# EAGLE design basestation_lorawan (EAGLE 9.6.2)
COMPONENTS: LoRaWAN; DESCRIPTION: Basismodul; DRAWING_VERSION: 1.0; DRAWN: Tobias Poppe; FIRMA: Tobias Poppe; PRINTDATE: 30.01.2023; PROJECT: Open-WaLeS; STATUS: Prod.

## Sheet 1 of 2
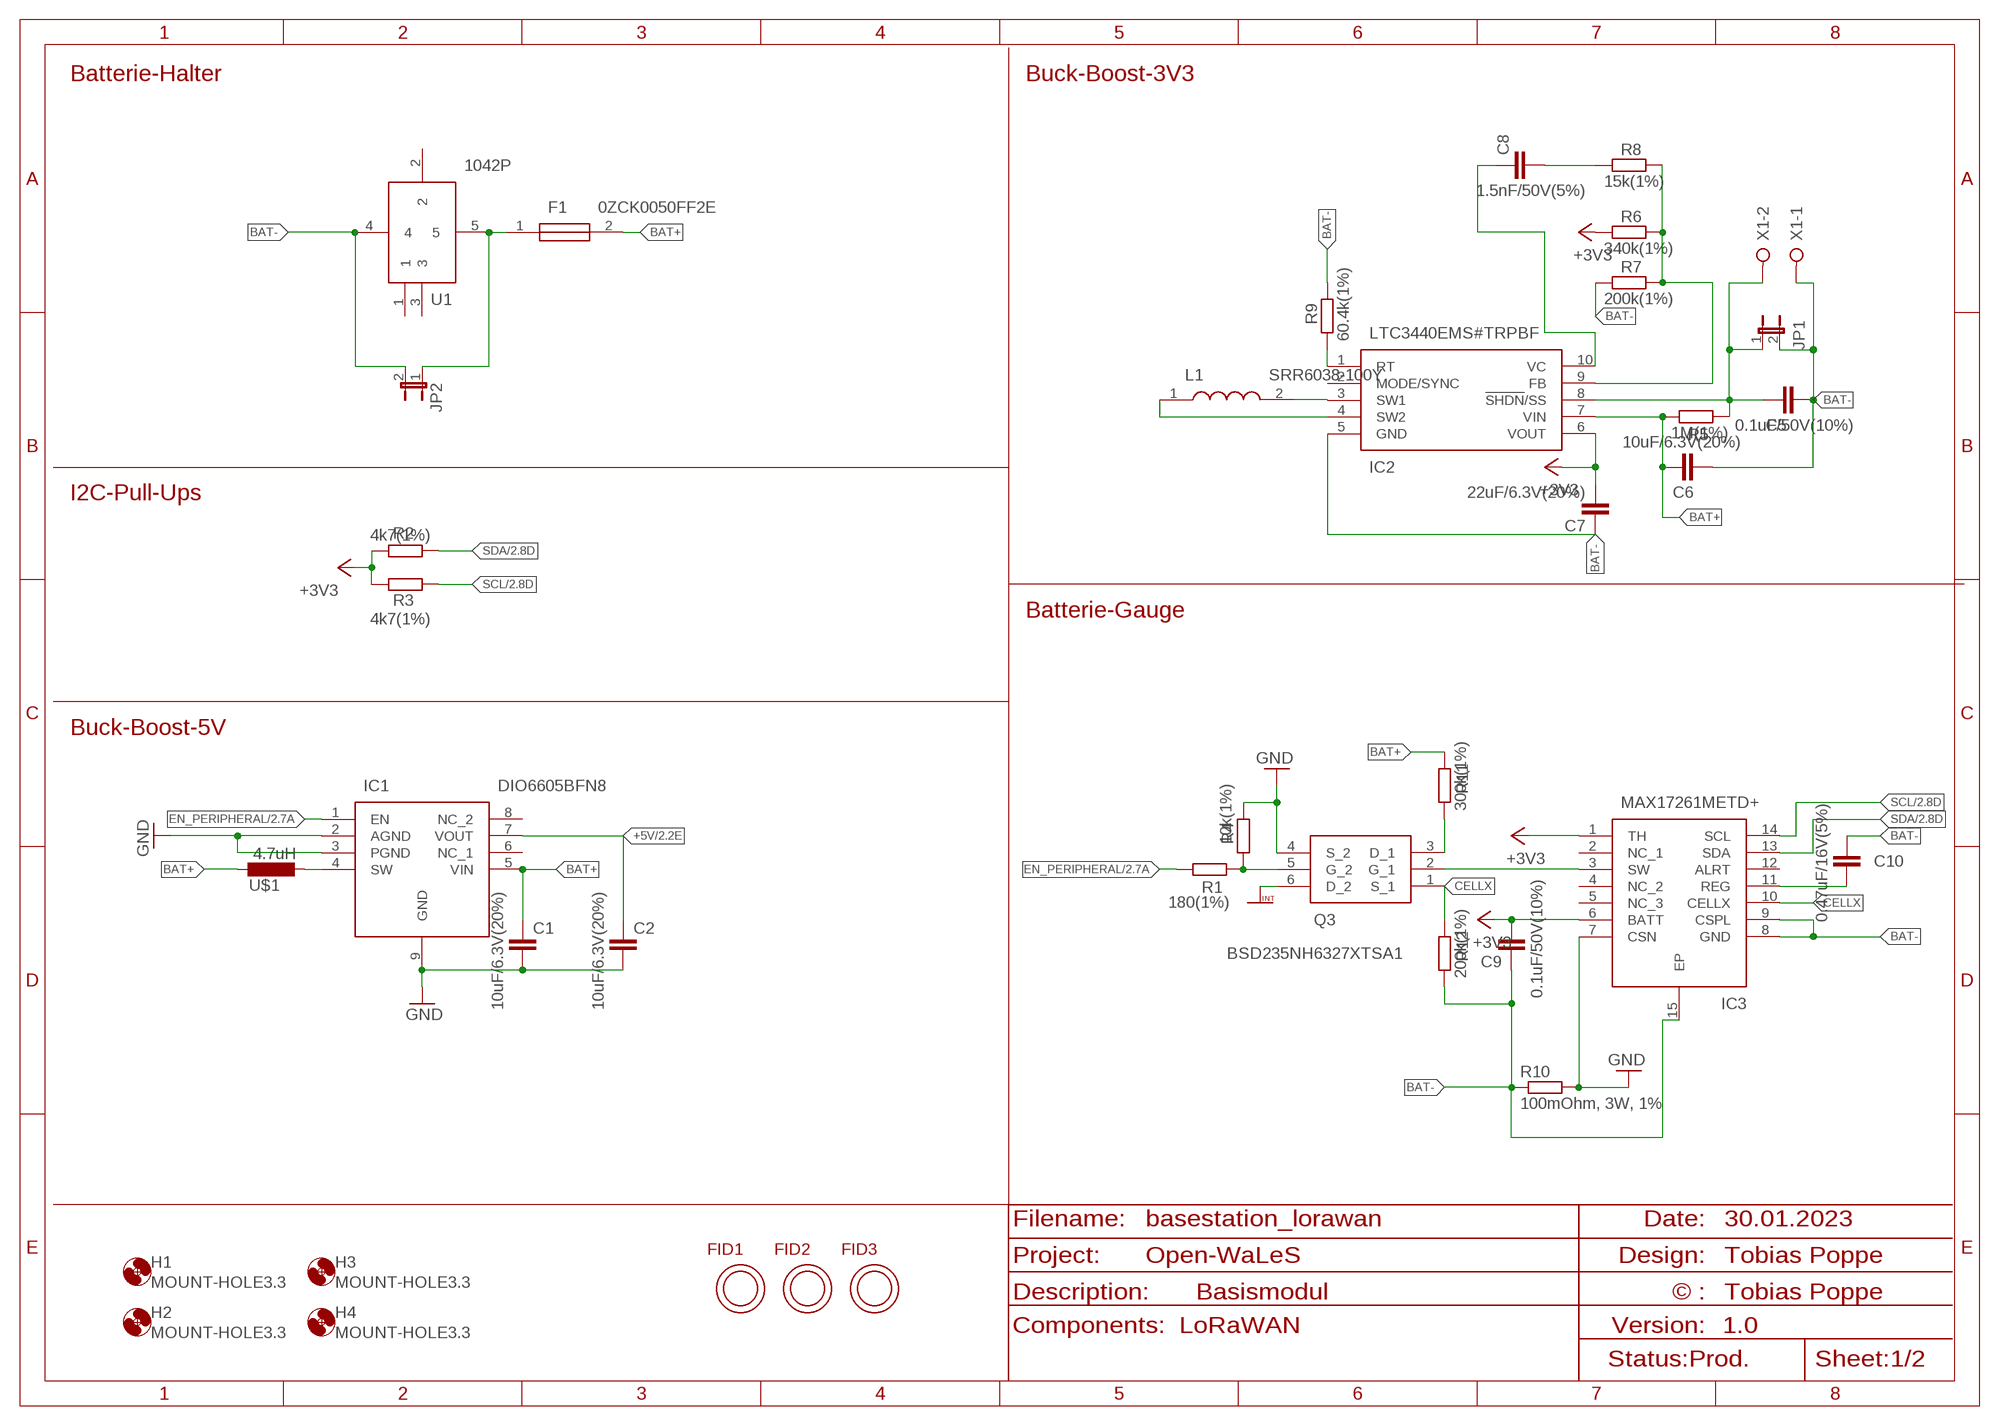
[diagram p0: schematic, sheet 1]

### Parts
C1  10uF/6.3V(20%)  C-EUC0805  [C0805]
C2  10uF/6.3V(20%)  C-EUC0805  [C0805]
C5  0.1uF/50V(10%)  C-EUC0805  [C0805]
C6  10uF/6.3V(20%)  C-EUC0805  [C0805]
C7  22uF/6.3V(20%)  C-EUC0805K  [C0805K]
C8  1.5nF/50V(5%)  C-EUC0805  [C0805]
C9  0.1uF/50V(10%)  C-EUC0805  [C0805]
C10  0.47uF/16V(5%)  C-EUC0805  [C0805]
F1  0ZCK0050FF2E  [FUSC2214X125N]
FID1  OPEN-PNP-FIDUCIAL  [OPEN-PNP-FIDUCIAL]
FID2  OPEN-PNP-FIDUCIAL  [OPEN-PNP-FIDUCIAL]
FID3  OPEN-PNP-FIDUCIAL  [OPEN-PNP-FIDUCIAL]
H1  MOUNT-HOLE3.3  [3,3]
H2  MOUNT-HOLE3.3  [3,3]
H3  MOUNT-HOLE3.3  [3,3]
H4  MOUNT-HOLE3.3  [3,3]
IC1  DIO6605BFN8  [SON50P300X200X80-9N]
IC2  LTC3440EMS#TRPBF  [SOP50P490X110-10N]
IC3  MAX17261METD+  [SON40P300X300X80-15N]
JP1  JP1E  [JP1]
JP2  JP1E  [JP1]
L1  SRR6038-100Y  SRR6038-330Y  [SRR6038330Y]
Q3  BSD235NH6327XTSA1  [SOT65P210X100-6N]
R1  180(1%)  R-EU_M0805  [M0805]
R2  4k7(1%)  R-EU_M0805  [M0805]
R3  4k7(1%)  R-EU_M0805  [M0805]
R4  10k(1%)  R-EU_M0805  [M0805]
R5  1M(1%)  R-EU_M0805  [M0805]
R6  340k(1%)  R-EU_M0805  [M0805]
R7  200k(1%)  R-EU_M0805  [M0805]
R8  15k(1%)  R-EU_M0805  [M0805]
R9  60.4k(1%)  R-EU_M0805  [M0805]
R10  100mOhm, 3W, 1%  R-EU_R2512  [R2512]
R11  300k(1%)  R-EU_M0805  [M0805]
R12  200k(1%)  R-EU_M0805  [M0805]
U1  1042P  [1042P]
U$1  4.7uH  L-0805  [R0805]
X1  W237-02P  [W237-132]

### Nets
+3V3: C7.2 C9.2 IC2.6(VOUT) IC3.1(TH) IC3.6(BATT) R2.2 R3.2 R6.1 ; also sheet 2
+5V: C2.1 IC1.7(VOUT) ; also sheet 2
BAT+: C1.1 C6.2 F1.2 IC1.5(VIN) IC2.7(VIN) R5.1 R11.2 U$1.1
BAT+_UNFUSED: F1.1 JP2.1 U1.5
BAT-: C5.2 C6.1 C7.1 C9.1 C10.1 IC2.5(GND) IC3.8(GND) IC3.9(CSPL) IC3.15(EP) JP1.2 JP2.2 R7.1 R9.2 R10.1 R12.1 U1.4 X1.1
CELLX: IC3.10(CELLX) Q3.1(S_1) R12.2
EN_PERIPHERAL: IC1.1(EN) R1.2 ; also sheet 2
GND: C1.2 C2.2 IC1.2(AGND) IC1.3(PGND) IC1.9(GND) IC3.7(CSN) Q3.4(S_2) R4.2 R10.2 ; also sheet 2
GNDINT: Q3.6(D_2) ; also sheet 2
N$1: IC1.4(SW) U$1.2
N$2: Q3.5(G_2) R1.1 R4.1
N$7: IC2.3(SW1) L1.2
N$8: IC2.4(SW2) L1.1
N$9: IC2.9(FB) R6.2 R7.2 R8.2
N$10: C5.1 IC2.8(!SHDN!/SS) JP1.1 R5.2 X1.2
N$11: C8.2 R8.1
N$12: C8.1 IC2.10(VC)
N$14: Q3.3(D_1) R11.1
REG: C10.2 IC3.11(REG)
RT: IC2.1(RT) R9.1
SCL: IC3.14(SCL) R3.1 ; also sheet 2
SDA: IC3.13(SDA) R2.1 ; also sheet 2
SW: IC3.3(SW) Q3.2(G_1)
Unconnected: IC1.6(NC_1) IC1.8(NC_2) IC2.2(MODE/SYNC) IC3.2(NC_1) IC3.4(NC_2) IC3.5(NC_3) IC3.12(ALRT) U1.1 U1.2 U1.3

### Notes on the sheet
- Batterie-Halter | Buck-Boost-3V3
- I2C-Pull-Ups
- Batterie-Gauge
- Buck-Boost-5V

## Sheet 2 of 2
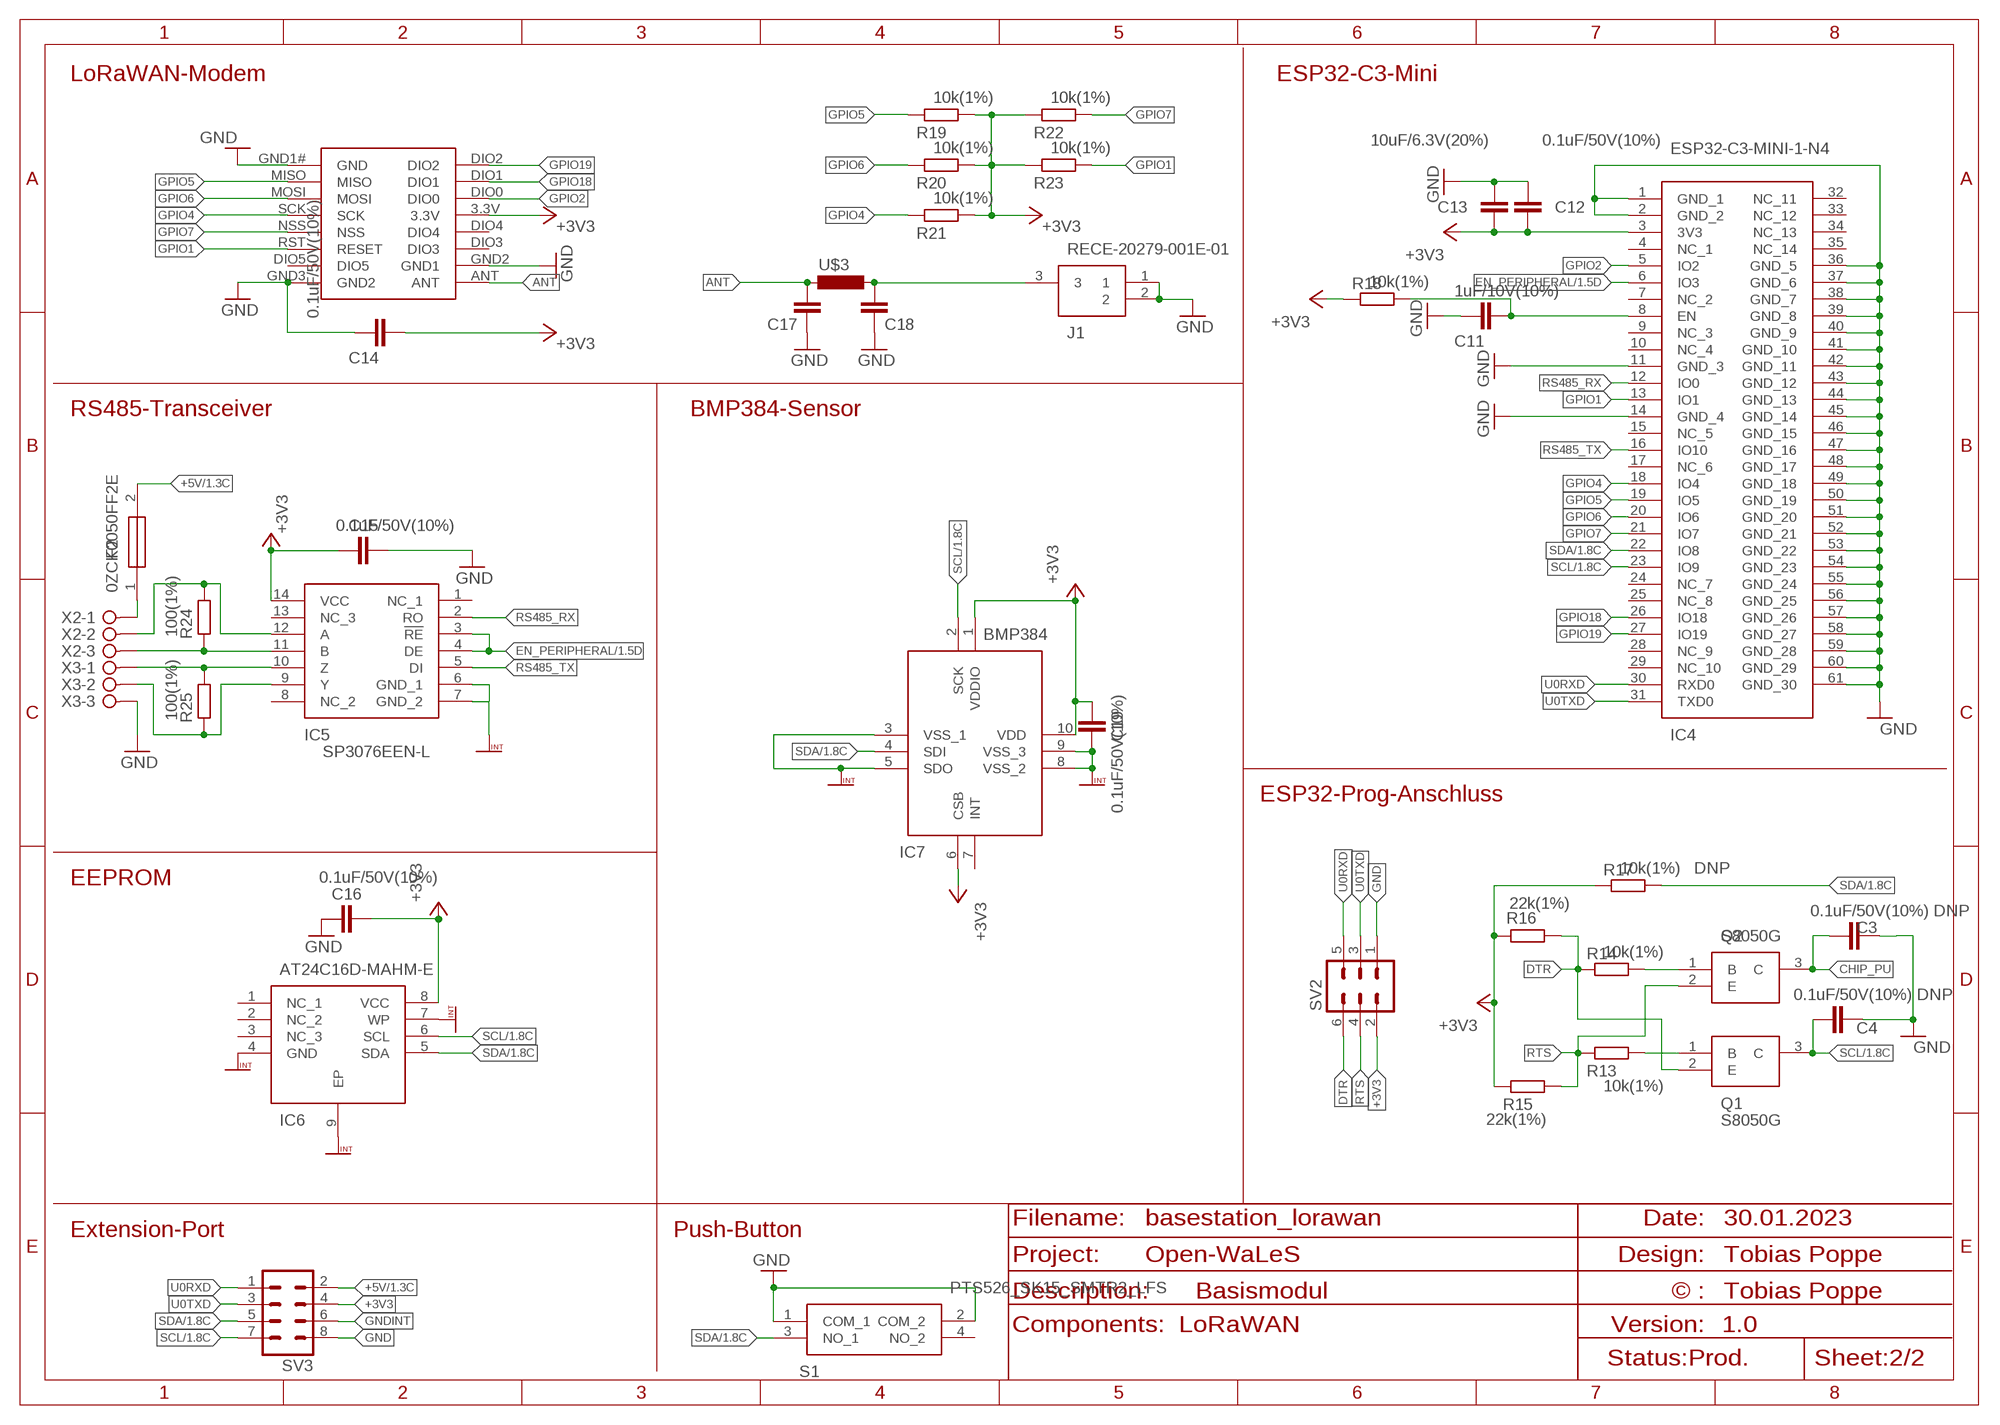
[diagram p1: schematic, sheet 2]

### Parts
C3  0.1uF/50V(10%) DNP  C-EUC0805  [C0805]
C4  0.1uF/50V(10%) DNP  C-EUC0805  [C0805]
C11  1uF/10V(10%)  C-EUC0805  [C0805]
C12  0.1uF/50V(10%)  C-EUC0805  [C0805]
C13  10uF/6.3V(20%)  C-EUC0805  [C0805]
C14  0.1uF/50V(10%)  C-EUC0805  [C0805]
C15  0.1uF/50V(10%)  C-EUC0805  [C0805]
C16  0.1uF/50V(10%)  C-EUC0805  [C0805]
C17  C-EUC0805K  [C0805K]
C18  C-EUC0805K  [C0805K]
C19  0.1uF/50V(10%)  C-EUC0805  [C0805]
F2  0ZCK0050FF2E  [FUSC2214X125N]
IC4  ESP32-C3-MINI-1-N4  [ESP32C3MINI1N4]
IC5  SP3076EEN-L  [SOIC127P600X175-14N]
IC6  AT24C16D-MAHM-E  [SON50P300X200X60-9N]
IC7  BMP384  [BMP384]
J1  RECE-20279-001E-01  [RECE.20279.001E.01]
Q1  S8050G  [SOT95P240X110-3N]
Q2  S8050G  [SOT95P240X110-3N]
R13  10k(1%)  R-EU_M0805  [M0805]
R14  10k(1%)  R-EU_M0805  [M0805]
R15  22k(1%)  R-EU_M0805  [M0805]
R16  22k(1%)  R-EU_M0805  [M0805]
R17  10k(1%) DNP  R-EU_M0805  [M0805]
R18  10k(1%)  R-EU_M0805  [M0805]
R19  10k(1%)  R-EU_M0805  [M0805]
R20  10k(1%)  R-EU_M0805  [M0805]
R21  10k(1%)  R-EU_M0805  [M0805]
R22  10k(1%)  R-EU_M0805  [M0805]
R23  10k(1%)  R-EU_M0805  [M0805]
R24  100(1%)  R-EU_M0805  [M0805]
R25  100(1%)  R-EU_M0805  [M0805]
S1  PTS526_SK15_SMTR2_LFS  [PTS526SK15SMTR2LFS]
SV2  MA03-2  [MA03-2]
SV3  MA04-2  [MA04-2]
U$2  RFM95W  [RFM95W]
U$3  L-0805  [R0805]
X2  W237-3E  [W237-3E]
X3  W237-3E  [W237-3E]

### Nets
+3V3: C12.1 C13.2 C14.1 C15.1 C16.2 C19.1 IC4.3(3V3) IC5.14(VCC) IC6.8(VCC) IC7.1(VDDIO) IC7.6(CSB) IC7.10(VDD) R15.2 R16.1 R17.2 R18.2 R19.1 R20.1 R21.1 R22.2 R23.2 SV2.2 SV3.4 U$2.3.3V ; also sheet 1
+5V: F2.2 SV3.2 ; also sheet 1
A: IC5.12(A) R24.2 X2.2
ANT: C17.1 U$2.ANT U$3.1
B: IC5.11(B) R24.1 X2.3
CHIP_PU: C3.2 C11.1 IC4.8(EN) Q2.3(C) R18.1
DTR: Q1.2(E) R14.2 R16.2 SV2.6
EN_PERIPHERAL: IC4.6(IO3) IC5.3(!RE) IC5.4(DE) ; also sheet 1
GND: C3.1 C4.1 C11.2 C12.2 C13.1 C14.2 C15.2 C16.1 C17.2 C18.2 IC4.1(GND_1) IC4.2(GND_2) IC4.11(GND_3) IC4.14(GND_4) IC4.36(GND_5) IC4.37(GND_6) IC4.38(GND_7) IC4.39(GND_8) IC4.40(GND_9) IC4.41(GND_10) IC4.42(GND_11) IC4.43(GND_12) IC4.44(GND_13) IC4.45(GND_14) IC4.46(GND_15) IC4.47(GND_16) IC4.48(GND_17) IC4.49(GND_18) IC4.50(GND_19) IC4.51(GND_20) IC4.52(GND_21) IC4.53(GND_22) IC4.54(GND_23) IC4.55(GND_24) IC4.56(GND_25) IC4.57(GND_26) IC4.58(GND_27) IC4.59(GND_28) IC4.60(GND_29) IC4.61(GND_30) J1.1 J1.2 S1.1(COM_1) S1.2(COM_2) SV2.1 SV3.8 U$2.GND1#(GND) U$2.GND2(GND1) U$2.GND3(GND2) X3.3 ; also sheet 1
GNDINT: C19.2 IC5.6(GND_1) IC5.7(GND_2) IC6.4(GND) IC6.7(WP) IC6.9(EP) IC7.3(VSS_1) IC7.5(SDO) IC7.8(VSS_2) IC7.9(VSS_3) SV3.6 ; also sheet 1
GPIO1: IC4.13(IO1) R23.1 U$2.RST(RESET)
GPIO2: IC4.5(IO2) U$2.DIO0
GPIO4: IC4.18(IO4) R21.2 U$2.SCK
GPIO5: IC4.19(IO5) R19.2 U$2.MISO
GPIO6: IC4.20(IO6) R20.2 U$2.MOSI
GPIO7: IC4.21(IO7) R22.1 U$2.NSS
GPIO18: IC4.26(IO18) U$2.DIO1
GPIO19: IC4.27(IO19) U$2.DIO2
N$3: Q2.1(B) R14.1
N$4: Q1.1(B) R13.1
N$16: F2.1 X2.1
N$19: C18.1 J1.3 U$3.2
RS485_RX: IC4.12(IO0) IC5.2(RO)
RS485_TX: IC4.16(IO10) IC5.5(DI)
RTS: Q2.2(E) R13.2 R15.1 SV2.4
SCL: C4.2 IC4.23(IO9) IC6.6(SCL) IC7.2(SCK) Q1.3(C) SV3.7 ; also sheet 1
SDA: IC4.22(IO8) IC6.5(SDA) IC7.4(SDI) R17.1 S1.3(NO_1) SV3.5 ; also sheet 1
U0RXD: IC4.30(RXD0) SV2.5 SV3.1
U0TXD: IC4.31(TXD0) SV2.3 SV3.3
Y: IC5.9(Y) R25.1 X3.2
Z: IC5.10(Z) R25.2 X3.1
Unconnected: IC4.4(NC_1) IC4.7(NC_2) IC4.9(NC_3) IC4.10(NC_4) IC4.15(NC_5) IC4.17(NC_6) IC4.24(NC_7) IC4.25(NC_8) IC4.28(NC_9) IC4.29(NC_10) IC4.32(NC_11) IC4.33(NC_12) IC4.34(NC_13) IC4.35(NC_14) IC5.1(NC_1) IC5.8(NC_2) IC5.13(NC_3) IC6.1(NC_1) IC6.2(NC_2) IC6.3(NC_3) IC7.7(INT) S1.4(NO_2) U$2.DIO3 U$2.DIO4 U$2.DIO5

### Notes on the sheet
- LoRaWAN-Modem | ESP32-C3-Mini
- RS485-Transceiver | BMP384-Sensor
- ESP32-Prog-Anschluss
- EEPROM
- Extension-Port | Push-Button

## Library data of the parts
C1 C2 C6 C13 = rcl:C-EU: CAPACITOR, European symbol; MOUSER: 963-JMK212BJ106MG-T; SPICEPREFIX: C
C3-C5 C9 C12 C14-C16 C19 = rcl:C-EU: CAPACITOR, European symbol; MOUSER: 80-C0805C104K5RACLR; SPICEPREFIX: C
C7 = rcl:C-EU: CAPACITOR, European symbol; MOUSER: 710-885012107005; SPICEPREFIX: C
C8 = rcl:C-EU: CAPACITOR, European symbol; MOUSER: 80-C0805C152J5GAC; SPICEPREFIX: C
C10 = rcl:C-EU: CAPACITOR, European symbol; MOUSER: 77-VJ0805Y474JXJTBC; SPICEPREFIX: C
C11 = rcl:C-EU: CAPACITOR, European symbol; MOUSER: 710-885012207078; SPICEPREFIX: C
C17 C18 = rcl:C-EU: CAPACITOR, European symbol; SPICEPREFIX: C
F1 F2 = samacsys:0ZCK0050FF2E: BEL FUSE - CIRCUIT PROTECTION - 0ZCK0050FF2E - Resettable Fuse, PPTC, 0805 (2012 Metric), 0ZCK Series, 6 VDC, 500 mA, 1 A, 0.1 s Source: Datasheet <https://eagle.componentsearchengine.com/Datasheets/2/0ZCK0050FF2E.pdf>; ARROW_PART_NUMBER: 0ZCK0050FF2E; ARROW_PRICE-STOCK: https://www.arrow.com/en/products/0zck0050ff2e/bel-group?region=nac; DESCRIPTION: BEL FUSE - CIRCUIT PROTECTION - 0ZCK0050FF2E - Resettable Fuse, PPTC, 0805 (2012 Metric), 0ZCK Series, 6 VDC, 500 mA, 1 A, 0.1 s; HEIGHT: 1.25mm; MANUFACTURER_NAME: Bel Circuit Protection; MANUFACTURER_PART_NUMBER: 0ZCK0050FF2E; MOUSER: 530-0ZCK0050FF2E
FID1-FID3 = topo-eng:OPEN-PNP-FIDUCIAL
H1-H4 = holes:MOUNT-HOLE: MOUNTING HOLE with drill center marker
IC1 = samacsys:DIO6605BFN8: Switching Voltage Regulators 5V Output High Efficiency 1.2MHz Syn Step-up converter Source: Datasheet <https://eu.mouser.com/datasheet/2/802/dioo_06292016_DIO6605B V0 2-1217633.pdf>; DESCRIPTION: Switching Voltage Regulators 5V Output High Efficiency 1.2MHz Syn Step-up converter; HEIGHT: 0.8mm; MANUFACTURER_NAME: DIOO; MANUFACTURER_PART_NUMBER: DIO6605BFN8; MOUSER_PART_NUMBER: 453-DIO6605BFN8
IC2 = samacsys:LTC3440EMS#TRPBF: Switching Voltage Regulators 500mA Synch. Buck-Boost Converter Source: Datasheet <https://www.analog.com/media/en/technical-documentation/data-sheets/3440fd.pdf>; ARROW_PART_NUMBER: LTC3440EMS#TRPBF; ARROW_PRICE-STOCK: https://www.arrow.com/en/products/ltc3440emstrpbf/analog-devices?region=nac; DESCRIPTION: Switching Voltage Regulators 500mA Synch. Buck-Boost Converter; HEIGHT: 1.1mm; MANUFACTURER_NAME: Analog Devices; MANUFACTURER_PART_NUMBER: LTC3440EMS#TRPBF; MOUSER_PART_NUMBER: 584-LTC3440EMS#TRPBF; MOUSER_PRICE-STOCK: https://www.mouser.co.uk/ProductDetail/Analog-Devices/LTC3440EMSTRPBF?qs=hVkxg5c3xu9HFklrpLlQPw%3D%3D
IC3 = samacsys:MAX17261METD+: Battery Management 5A Multi-Cell Fuel Gauge with ModelGauge m5 EZ Source: Datasheet <https://datasheets.maximintegrated.com/en/ds/MAX17261.pdf>; ARROW_PART_NUMBER: MAX17261METD+; ARROW_PRICE-STOCK: https://www.arrow.com/en/products/max17261metd/maxim-integrated?region=nac; DESCRIPTION: Battery Management 5A Multi-Cell Fuel Gauge with ModelGauge m5 EZ; HEIGHT: 0.8mm; MANUFACTURER_NAME: Maxim Integrated; MANUFACTURER_PART_NUMBER: MAX17261METD+; MOUSER_PART_NUMBER: 700-MAX17261METD+; MOUSER_PRICE-STOCK: https://www.mouser.co.uk/ProductDetail/Maxim-Integrated/MAX17261METD%2b?qs=MLItCLRbWszs6L8AG1hBmQ%3D%3D
IC4 = samacsys:ESP32-C3-MINI-1-N4: SMD MODULE, ESP32-C3FN4, PCB ANT Source: Datasheet <https://www.mouser.com/datasheet/2/891/Espressif_ESP32_C3_MINI_1_Datasheet-2006822.pdf>; DESCRIPTION: SMD MODULE, ESP32-C3FN4, PCB ANT; HEIGHT: 2.55mm; MANUFACTURER_NAME: Espressif Systems; MANUFACTURER_PART_NUMBER: ESP32-C3-MINI-1-N4; MOUSER: 356-ESP32-C3-MINI1N4; MOUSER_PART_NUMBER: 356-ESP32-C3-MINI1N4; MOUSER_PRICE-STOCK: https://www.mouser.co.uk/ProductDetail/Espressif-Systems/ESP32-C3-MINI-1-N4?qs=stqOd1AaK7%252B%2FpH3qqyGehA%3D%3D
IC5 = samacsys:SP3076EEN-L: RS-422/RS-485 Interface IC RS485/RS422 Driver/ Receiver Transceiver Source: Datasheet <https://www.exar.com/content/document.ashx?id=1399>; DESCRIPTION: RS-422/RS-485 Interface IC RS485/RS422 Driver/ Receiver Transceiver; HEIGHT: 1.75mm; MANUFACTURER_NAME: MaxLinear, Inc.; MANUFACTURER_PART_NUMBER: SP3076EEN-L; MOUSER_PART_NUMBER: 701-SP3076EEN-L; MOUSER_PRICE-STOCK: https://www.mouser.co.uk/ProductDetail/MaxLinear/SP3076EEN-L?qs=H%252BP%2FcHWii3dfBcWqKh1L5g%3D%3D
IC6 = samacsys:AT24C16D-MAHM-E: EEPROM EEPROM 1.7-3.6V,1MHz Ind Tmp, 8-UDFN Source: Datasheet <http://ww1.microchip.com/downloads/en/devicedoc/atmel-8906f-seeprom-at24c16d-datasheet.pdf>; ARROW_PART_NUMBER: AT24C16D-MAHM-E; ARROW_PRICE-STOCK: https://www.arrow.com/en/products/at24c16d-mahm-e/microchip-technology?region=nac; DESCRIPTION: EEPROM EEPROM 1.7-3.6V,1MHz Ind Tmp, 8-UDFN; HEIGHT: 0.6mm; MANUFACTURER_NAME: Microchip; MANUFACTURER_PART_NUMBER: AT24C16D-MAHM-E; MOUSER: 579-AT24C16D-MAHM-E; MOUSER_PART_NUMBER: 579-AT24C16D-MAHM-E; MOUSER_PRICE-STOCK: https://www.mouser.co.uk/ProductDetail/Microchip-Technology-Atmel/AT24C16D-MAHM-E?qs=CM3LqkkxGd7BNRUYGy8aTg%3D%3D
IC7 = samacsys:BMP384: Board Mount Pressure Sensors Absolute Pressure Sensor Source: Datasheet <https://www.mouser.in/datasheet/2/783/bst_bmp384_ds003-1954011.pdf>; DESCRIPTION: Board Mount Pressure Sensors Absolute Pressure Sensor; HEIGHT: 1mm; MANUFACTURER_NAME: Bosch Sensortec; MANUFACTURER_PART_NUMBER: BMP384; MOUSER_PART_NUMBER: 262-BMP384; MOUSER_PRICE-STOCK: https://www.mouser.co.uk/ProductDetail/Bosch-Sensortec/BMP384?qs=IS%252B4QmGtzzqB3KCclqIEVQ%3D%3D
J1 = samacsys:RECE-20279-001E-01: RF Connectors / Coaxial Connectors ONBRD IPEX MHF RECEPTACLE Source: Datasheet; DESCRIPTION: RF Connectors / Coaxial Connectors ONBRD IPEX MHF RECEPTACLE; HEIGHT: mm; MANUFACTURER_NAME: Taoglas; MANUFACTURER_PART_NUMBER: RECE-20279-001E-01; MOUSER: 960-RECE20279001E01; MOUSER_PART_NUMBER: N/A; MOUSER_PRICE-STOCK: https://www.mouser.co.uk/ProductDetail/Taoglas/RECE-20279-001E-01?qs=WUa1z%2FNV9%252B3mVij1vDlP0A%3D%3D
JP1 JP2 = jumper:JP1E: JUMPER
L1 = samacsys:SRR6038-330Y: Bourns SRR6038 Series Shielded Wire-wound SMD Inductor with a Ferrite Core, 33 uH +/-30% 1.2A Idc Q:8.6 Source: Datasheet <http://www.bourns.com/docs/Product-Datasheets/SRR6038.pdf>; ARROW_PART_NUMBER: SRR6038-330Y; ARROW_PRICE-STOCK: https://www.arrow.com/en/products/srr6038-330y/bourns; DESCRIPTION: Bourns SRR6038 Series Shielded Wire-wound SMD Inductor with a Ferrite Core, 33 uH +/-30% 1.2A Idc Q:8.6; HEIGHT: 4mm; MANUFACTURER_NAME: Bourns; MANUFACTURER_PART_NUMBER: SRR6038-330Y; MOUSER_PART_NUMBER: 652-SRR6038-100Y; MOUSER_PRICE-STOCK: https://www.mouser.co.uk/ProductDetail/Bourns/SRR6038-330Y?qs=m8myXnDJXpUSPmw%252BqVnSSA%3D%3D
Q1 Q2 = samacsys:S8050G: Silicon Epitaxial Planar Transistor Source: Datasheet <http://www.gmesemi.com/KUpload/product/TR/S8050 SOT-23.pdf>; DESCRIPTION: Silicon Epitaxial Planar Transistor; HEIGHT: 1.1mm; MANUFACTURER_NAME: Galaxy; MANUFACTURER_PART_NUMBER: S8050G; MOUSER: 750-SS8050-G
Q3 = samacsys:BSD235NH6327XTSA1: MOSFET N-Ch 20V 950mA SOT-363-6 Source: Datasheet <http://uk.rs-online.com/web/p/products/1655872>; ARROW_PART_NUMBER: BSD235NH6327XTSA1; ARROW_PRICE-STOCK: https://www.arrow.com/en/products/bsd235nh6327xtsa1/infineon-technologies-ag?region=nac; DESCRIPTION: MOSFET N-Ch 20V 950mA SOT-363-6; HEIGHT: 1mm; MANUFACTURER_NAME: Infineon; MANUFACTURER_PART_NUMBER: BSD235NH6327XTSA1; MOUSER_PART_NUMBER: 726-BSD235NH6327XTS; MOUSER_PRICE-STOCK: https://www.mouser.co.uk/ProductDetail/Infineon-Technologies/BSD235NH6327XTSA1?qs=LxJ0xX%2FWJR4JaNBfWcvoTw%3D%3D
R1-R9 R11-R25 = rcl:R-EU_: RESISTOR, European symbol; SPICEPREFIX: R
R10 = rcl:R-EU_: RESISTOR, European symbol; MOUSER: 652-CRA2512FZR100ELF; SPICEPREFIX: R
S1 = samacsys:PTS526_SK15_SMTR2_LFS: Tact 5.2 x 5.2, 1.5 mm H, 260gf, G leads, No ground pin, metal actuator Source: Datasheet <https://www.ckswitches.com/media/2780/pts526.pdf>; ARROW_PART_NUMBER: PTS526 SK15 SMTR2 LFS; ARROW_PRICE-STOCK: https://www.arrow.com/en/products/pts526-sk15-smtr2-lfs/ck?region=nac; DESCRIPTION: Tact 5.2 x 5.2, 1.5 mm H, 260gf, G leads, No ground pin, metal actuator; HEIGHT: 1.65mm; MANUFACTURER_NAME: C & K COMPONENTS; MANUFACTURER_PART_NUMBER: PTS526 SK15 SMTR2 LFS; MOUSER: 611-PTS526SK15SMR2L; MOUSER_PART_NUMBER: 611-PTS526SK15SMR2L; MOUSER_PRICE-STOCK: https://www.mouser.co.uk/ProductDetail/CK/PTS526-SK15-SMTR2-LFS?qs=UXgszm6BlbF5Ezp94JAQtw%3D%3D
SV2 = con-lstb:MA03-2: PIN HEADER; OC_FARNELL: unknown; OC_NEWARK: unknown
SV3 = con-lstb:MA04-2: PIN HEADER; OC_FARNELL: unknown; OC_NEWARK: unknown
U1 = samacsys:1042P: KEYSTONE - 1042P - BATTERY HOLDER, 18650, SMD Source: Datasheet <http://www.keyelco.com/product-pdf.cfm?p=13957>; ARROW_PART_NUMBER: 1042P; ARROW_PRICE-STOCK: https://www.arrow.com/en/products/1042p/keystone-electronics?region=europe; DESCRIPTION: KEYSTONE - 1042P - BATTERY HOLDER, 18650, SMD; HEIGHT: 14mm; MANUFACTURER_NAME: Keystone Electronics; MANUFACTURER_PART_NUMBER: 1042P; MOUSER_PART_NUMBER: 534-1042P; MOUSER_PRICE-STOCK: https://www.mouser.co.uk/ProductDetail/Keystone-Electronics/1042P?qs=g2rIOKKlpoboHyq0g1zn1A%3D%3D
U$1 = topo-eng:L-0805; MOUSER: 963-MBMK2520T4R7M
U$2 = topo-eng:RFM95W
U$3 = topo-eng:L-0805
X1 = con-wago-508:W237-02P: WAGO SREW CLAMP; OC_FARNELL: unknown; OC_NEWARK: unknown
X2 X3 = con-wago-508:W237-3E: WAGO SREW CLAMP; OC_FARNELL: unknown; OC_NEWARK: unknown

## Board
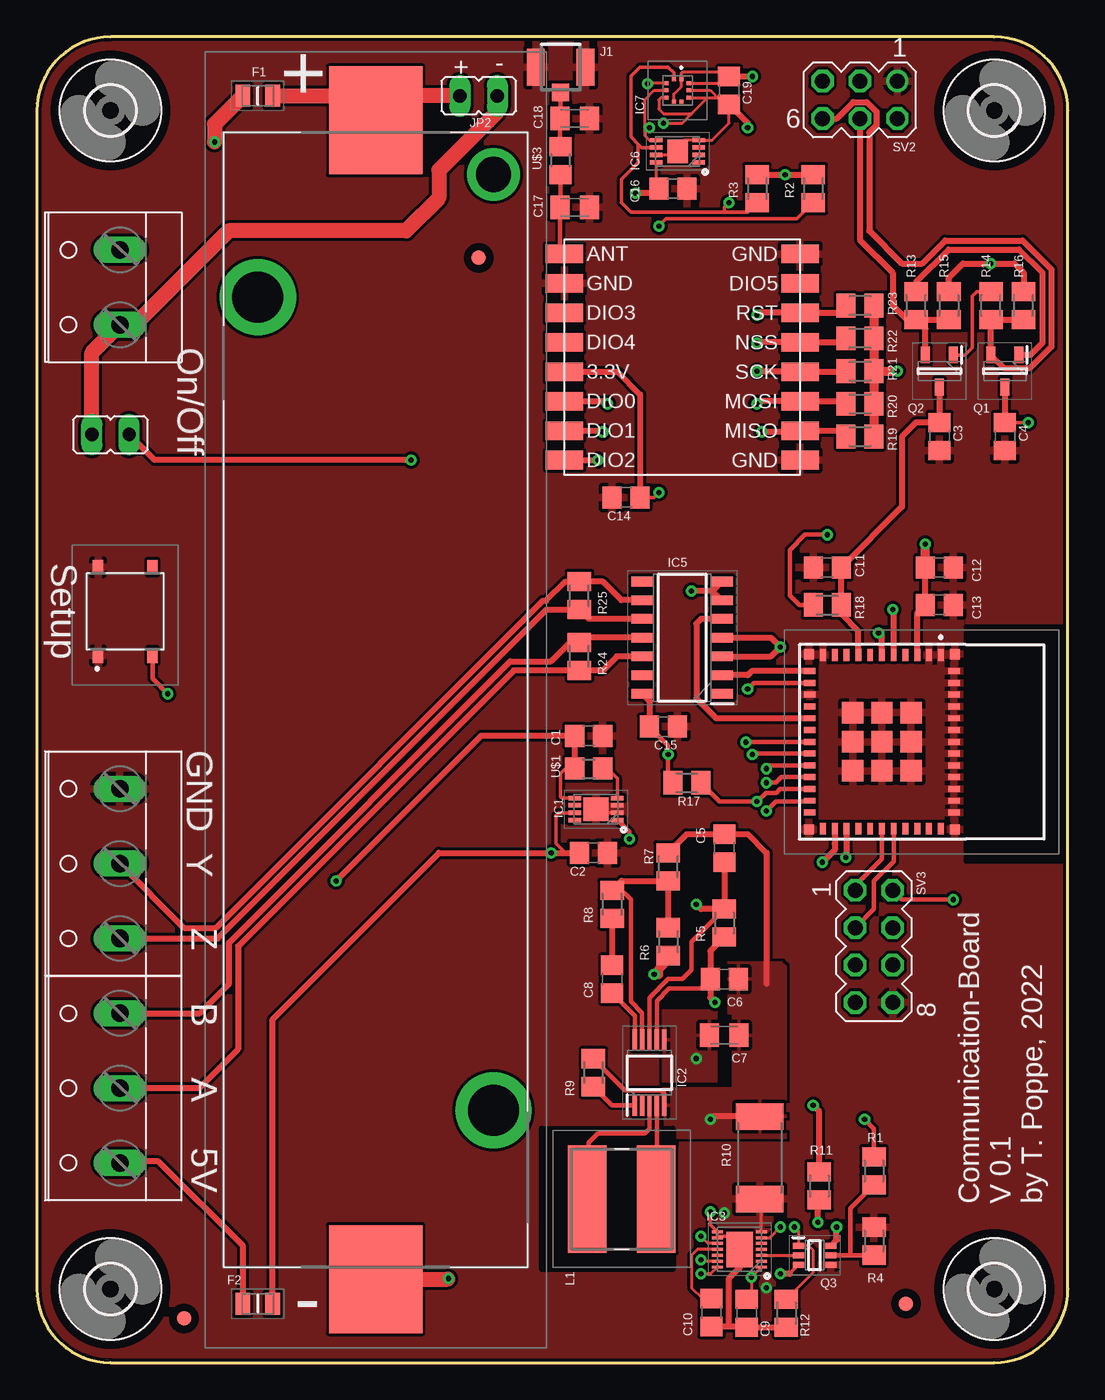
[diagram p2: board, top side]
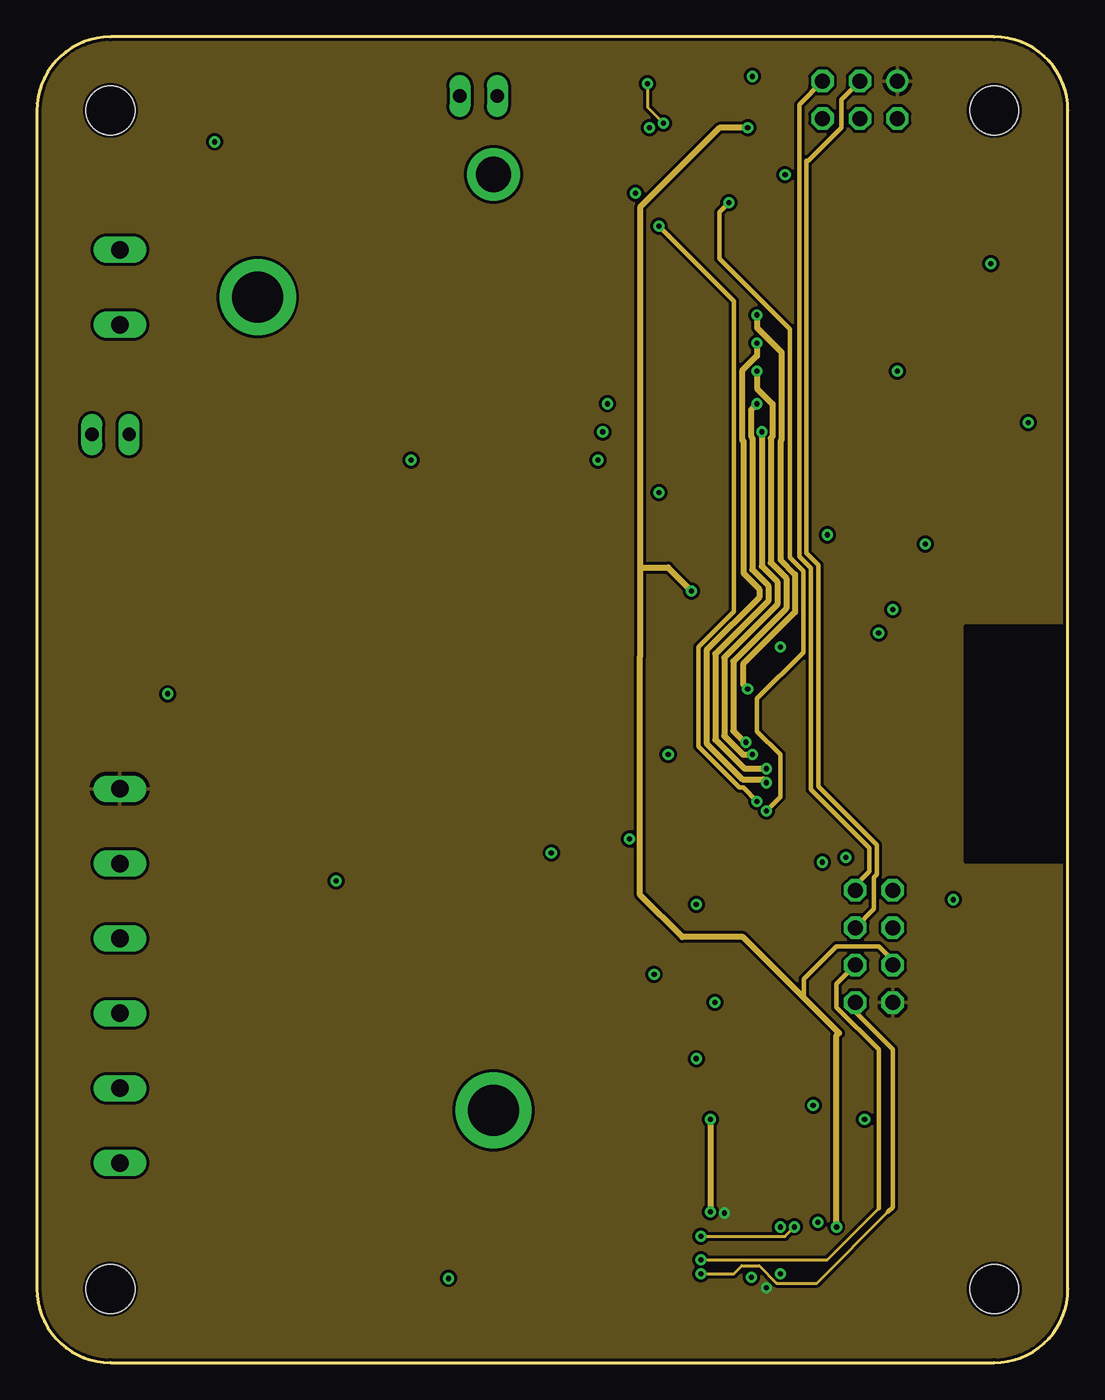
[diagram p3: board, inner layer Route2]
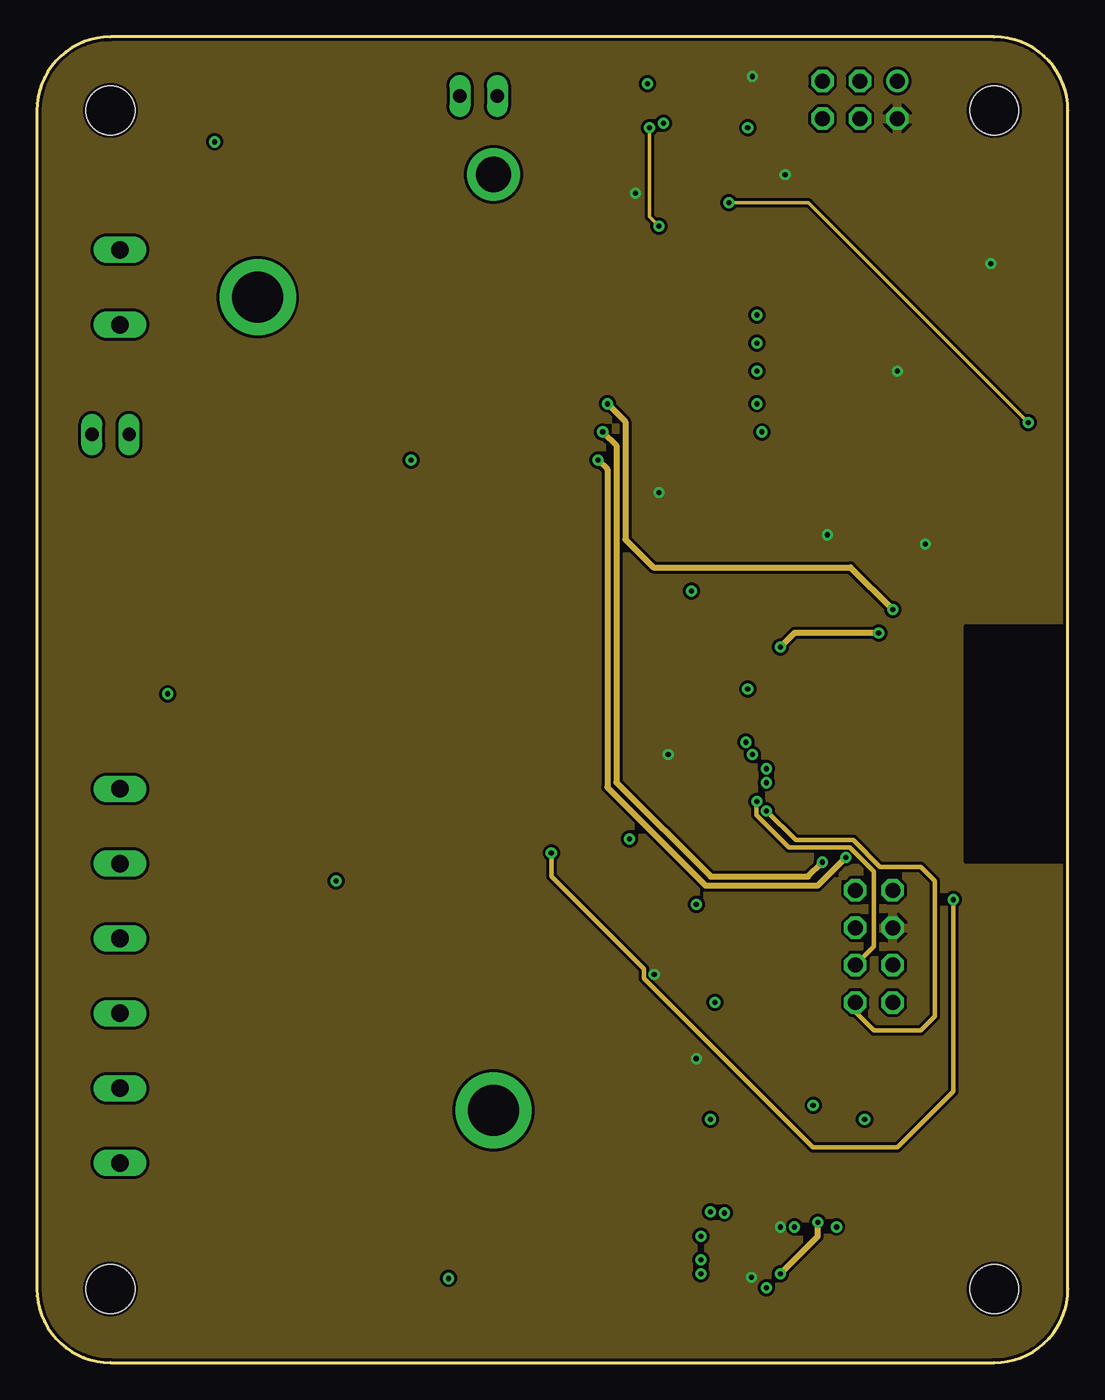
[diagram p4: board, inner layer Route15]
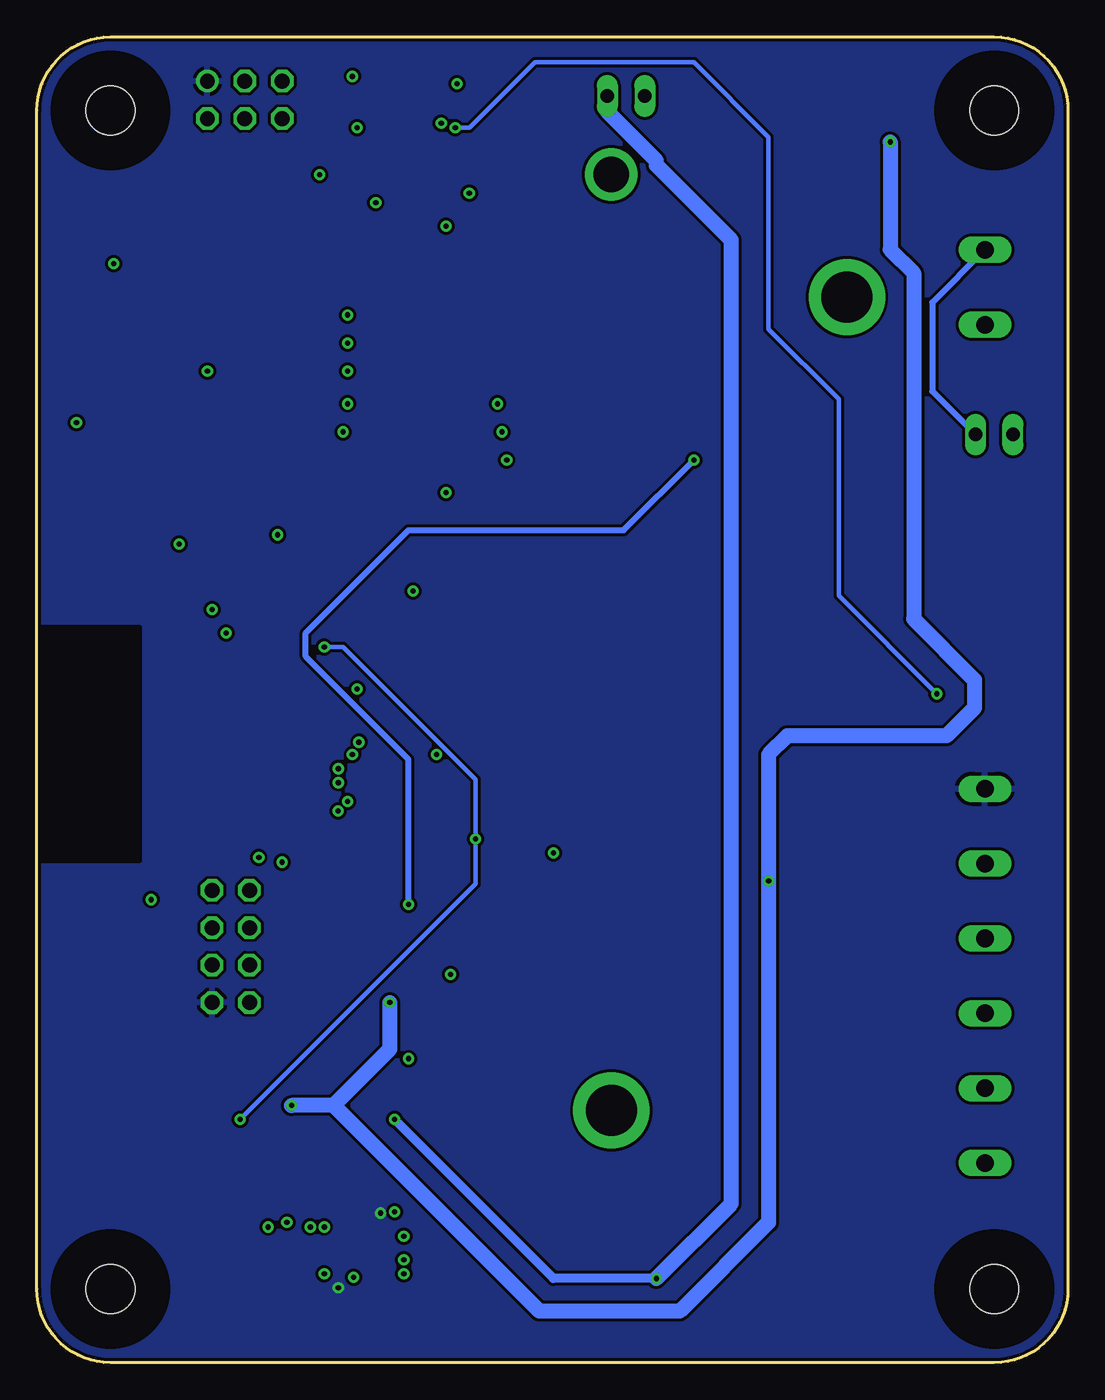
[diagram p5: board, bottom side, seen from below]

Size 70 x 90 mm. Coordinates in mm from the lower left corner, seen from the top.
Outline: 0,85 0,5 arc90 5,0 65,0 arc90 70,5 70,85 arc90 65,90 5,90 arc90 0,85
Copper layers (1+2*15*16): Top 0.035mm / dielectric 0.2mm / Route2 0.0175mm / dielectric 1.065mm / Route15 0.0175mm / dielectric 0.2mm / Bottom 0.035mm
Design rules "jlcpcb_4_layer *": minimum track width 3.5mil, minimum drill 0.2mm, track to track 0.2mm, track to pad 6mil, pad to pad 6mil, via to via 6mil, smd to smd 6mil, copper to edge 0.2mm, drill to drill 6mil, minimum pad ring 10mil, minimum via ring 8mil, stop-mask expansion 4mil, vias tented up to drill 0mil, thermal gap 10mil

### Footprints (pad centres in the part's own frame; a part is rotated, then mirrored left to right if it is on the bottom)
C0805 = smd 1.3 x 1.5: 1 -0.95,0; 2 0.95,0
C0805K = smd 1.3 x 1.6: 1 -1,0; 2 1,0
FUSC2214X125N = smd 1 x 1.52: 1 -1.01,0; 2 1.01,0
OPEN-PNP-FIDUCIAL = smd 1 x 1: FID$1 0,0
3,3 = hole 3.3: 0,0
SON50P300X200X80-9N = smd 0.85 x 0.3: 1 -1.45,0.75; 2 -1.45,0.25; 3 -1.45,-0.25; 4 -1.45,-0.75; 5 1.45,-0.75; 6 1.45,-0.25; 7 1.45,0.25; 8 1.45,0.75 | smd 1.7 x 1.6: 9 0,0
SOP50P490X110-10N = smd 1.425 x 0.3: 1 -2.212,1; 2 -2.212,0.5; 3 -2.212,0; 4 -2.212,-0.5; 5 -2.212,-1; 6 2.212,-1; 7 2.212,-0.5; 8 2.212,0; 9 2.212,0.5; 10 2.212,1
SON40P300X300X80-15N = smd 0.75 x 0.2: 1 -1.5,1.2; 2 -1.5,0.8; 3 -1.5,0.4; 4 -1.5,0; 5 -1.5,-0.4; 6 -1.5,-0.8; 7 -1.5,-1.2; 8 1.5,-1.2; 9 1.5,-0.8; 10 1.5,-0.4; 11 1.5,0; 12 1.5,0.4; 13 1.5,0.8; 14 1.5,1.2 | smd 1.8 x 2.4: 15 0,0
ESP32C3MINI1N4 = smd 0.8 x 0.4: 1 -5.9,4; 2 -5.9,3.2; 3 -5.9,2.4; 4 -5.9,1.6; 5 -5.9,0.8; 6 -5.9,0; 7 -5.9,-0.8; 8 -5.9,-1.6; 9 -5.9,-2.4; 10 -5.9,-3.2; 11 -5.9,-4; 25 5.9,-4; 26 5.9,-3.2; 27 5.9,-2.4; 28 5.9,-1.6; 29 5.9,-0.8; 30 5.9,0; 31 5.9,0.8; 32 5.9,1.6; 33 5.9,2.4; 34 5.9,3.2; 35 5.9,4 | smd 0.4 x 0.8: 12 -4.8,-4.9; 13 -4,-4.9; 14 -3.2,-4.9; 15 -2.4,-4.9; 16 -1.6,-4.9; 17 -0.8,-4.9; 18 0,-4.9; 19 0.8,-4.9; 20 1.6,-4.9; 21 2.4,-4.9; 22 3.2,-4.9; 23 4,-4.9; 24 4.8,-4.9; 36 4.8,4.9; 37 4,4.9; 38 3.2,4.9; 39 2.4,4.9; 40 1.6,4.9; 41 0.8,4.9; 42 0,4.9; 43 -0.8,4.9; 44 -1.6,4.9; 45 -2.4,4.9; 46 -3.2,4.9; 47 -4,4.9; 48 -4.8,4.9 | smd 1.45 x 1.45: 49 0,0; 50 1.975,1.975; 51 0,1.975; 52 -1.975,1.975; 53 -1.975,0; 54 -1.975,-1.975; 55 0,-1.975; 56 1.975,-1.975; 57 1.975,0 | smd 0.7 x 0.7: 58 -5.95,4.95; 59 -5.95,-4.95; 60 5.95,-4.95; 61 5.95,4.95
SOIC127P600X175-14N = smd 1.5 x 0.65: 1 -2.7,3.81; 2 -2.7,2.54; 3 -2.7,1.27; 4 -2.7,0; 5 -2.7,-1.27; 6 -2.7,-2.54; 7 -2.7,-3.81; 8 2.7,-3.81; 9 2.7,-2.54; 10 2.7,-1.27; 11 2.7,0; 12 2.7,1.27; 13 2.7,2.54; 14 2.7,3.81
SON50P300X200X60-9N = smd 0.85 x 0.3: 1 -1.45,0.75; 2 -1.45,0.25; 3 -1.45,-0.25; 4 -1.45,-0.75; 5 1.45,-0.75; 6 1.45,-0.25; 7 1.45,0.25; 8 1.45,0.75 | smd 1.4 x 1.6: 9 0,0
BMP384 = smd 0.27 x 0.285: 1 0.25,0.758; 2 -0.25,0.758; 6 -0.25,-0.758; 7 0.25,-0.758 | smd 0.285 x 0.27: 3 -0.757,0.5; 4 -0.757,0; 5 -0.757,-0.5; 8 0.757,-0.5; 9 0.757,0; 10 0.757,0.5
RECE.20279.001E.01 = smd 1.2 x 2.5: 1 -1.685,0; 2 1.685,0 | smd 1.15 x 1.2: 3 0,-1.73
JP1 = drill 0.914 long: 1 0,-1.27; 2 0,1.27
SRR6038330Y = smd 7.3 x 2.6: 1 0,2.35; 2 0,-2.35
SOT95P240X110-3N = smd 1.15 x 0.6: 1 -1.1,0.95; 2 -1.1,-0.95; 3 1.1,0
SOT65P210X100-6N = smd 0.75 x 0.4: 1 -1.1,0.65; 2 -1.1,0; 3 -1.1,-0.65; 4 1.1,-0.65; 5 1.1,0; 6 1.1,0.65
M0805 = smd 1.3 x 1.6: 1 -0.95,0; 2 0.95,0
R2512 = smd 1.8 x 3.2: 1 -2.8,0; 2 2.8,0
PTS526SK15SMTR2LFS = smd 1 x 0.7: 1 -3,1.85; 2 3,1.85; 3 -3,-1.85; 4 3,-1.85
MA03-2 = drill 1.016: 1 -2.54,-1.27 | drill 1.016 octagon: 2 -2.54,1.27; 3 0,-1.27; 4 0,1.27; 5 2.54,-1.27; 6 2.54,1.27
MA04-2 = drill 1.016 octagon: 1 -3.81,-1.27; 2 -3.81,1.27; 3 -1.27,-1.27; 4 -1.27,1.27; 5 1.27,-1.27; 6 1.27,1.27; 7 3.81,-1.27; 8 3.81,1.27
1042P = drill 3.45 pad 5.175: 1 -27.87,-8; 2 27.33,8 | drill 2.39 pad 3.585: 3 35.66,-8 | smd 7.34 x 6.35: 4 -39.33,0; 5 39.33,0
R0805 = smd 1.3 x 1.5: 1 -0.95,0; 2 0.95,0
RFM95W = smd 2.54 x 1.27: 3.3V 8,1; ANT 8,-7; DIO0 8,3; DIO1 8,5; DIO2 8,7; DIO3 8,-3; DIO4 8,-1; DIO5 -8,-5; GND1# -8,7; GND2 -8,-7; GND3 8,-5; MISO -8,5; MOSI -8,3; NSS -8,-1; RST -8,-3; SCK -8,1
W237-132 = drill 1.194 long: 1 -2.54,-0.635; 2 2.54,-0.635
W237-3E = drill 1.194 long: 1 -5.08,-0.635; 2 0,-0.635; 3 5.08,-0.635

### Placement (x,y rotation side)
C1  37.47,42.55 0 top
C2  37.78,34.61 0 top
C3  61.28,62.87 90 top
C4  65.72,62.87 90 top
C5  46.67,34.92 90 top
C6  46.67,26.04 180 top
C7  46.67,22.23 180 top
C8  39.05,26.04 90 top
C9  48.19,3.36 90 top
C10  45.8,3.41 90 top
C11  53.66,53.98 180 top
C12  61.28,53.98 0 top
C13  61.28,51.44 180 top
C14  40.01,58.74 180 top
C15  42.55,43.18 0 top
C16  43.18,79.69 180 top
C17  36.51,78.42 0 top
C18  36.51,84.45 0 top
C19  46.99,86.36 270 top
F1  15,86 180 top
F2  15,4 0 top
FID1  30,75 0 top
FID2  10,3 0 top
FID3  59,4 0 top
H1  5,5 0 top
H2  5,85 0 top
H3  65,5 0 top
H4  65,85 0 top
IC1  37.96,37.58 180 top
IC2  41.59,19.68 90 top
IC3  47.7,7.69 180 top
IC4  57.37,42.15 270 top
IC5  43.81,49.21 180 top
IC6  43.5,82.23 180 top
IC7  43.5,86.36 0 top
J1  35.56,87.95 0 top
JP1  5,63 90 top
JP2  30,86 270 top
L1  39.71,11.11 270 top
Q1  65.72,67.31 270 top
Q2  61.28,67.31 270 top
Q3  52.8,7.29 0 top
R1  56.83,13.02 90 top
R2  52.7,79.69 90 top
R3  48.9,79.69 90 top
R4  56.83,8.26 90 top
R5  46.67,29.84 90 top
R6  42.86,28.57 90 top
R7  42.86,33.66 270 top
R8  39.05,31.11 90 top
R9  37.78,19.68 90 top
R10  49.07,13.91 270 top
R11  53.12,12 90 top
R12  50.88,3.36 90 top
R13  59.69,71.75 270 top
R14  64.77,71.75 270 top
R15  61.91,71.75 90 top
R16  66.99,71.75 270 top
R17  44.13,39.37 180 top
R18  53.66,51.44 180 top
R19  55.88,62.87 180 top
R20  55.88,65.09 180 top
R21  55.88,67.31 180 top
R22  55.88,69.53 0 top
R23  55.88,71.75 0 top
R24  36.83,47.94 270 top
R25  36.83,52.07 270 top
S1  6,51 90 top
SV2  55.88,85.72 180 top
SV3  56.83,28.26 270 top
U1  23,45 90 top
U$1  37.47,40.32 0 top
U$2  43.81,68.26 180 top
U$3  35.56,81.6 90 top
X1  5,73 90 top
X2  5,18.64 90 top
X3  5,33.88 90 top

### Tracks (layer width: path | path; a pad name or v marks a point on that pad's centre or on a via)
+3V3  (via drill 0.35)
  Top 0.2: IC7.10 46.54,86.86 C19.1 | C19.1 46.67,87.63 43.81,87.63 43.75,87.56 IC7.1 43.75,86.61 43.25,86.11 IC7.6 | IC6.8 42.05,79.88 C16.2 | IC3.6 49.77,8.49 | 49.77,8.49 49.85,8.57 | 49.77,8.49 v50.48,9.21
  Top 0.203: IC3.1 v48.51,5.79 48.51,4.62 C9.2
  Top 0.254: C14.1 41.91,58.74 v42.23,59.05
  Top 0.305: C15.1 42.86,41.91 v42.86,41.27 42.86,39.69 R17.2 | R18.2 51.76,51.44 51.12,52.07 51.12,55.17 52.15,56.2 v53.66,56.2
  Top 0.406: U$2.3.3V 39.42,67.26 40.96,65.72 C14.1 | IC4.3 59.77,50.88 C13.2 C12.1 | R15.2 61.91,73.66 62.87,74.61 v64.77,74.61 66.36,74.61 66.99,73.98 R16.1 | C19.1 v48.58,87.31 | C16.2 41.91,79.38 v40.64,79.38 | R3.2 v50.8,80.64 R2.2 | IC5.14 41.59,44.92 C15.1
  Top 0.61: v41.91,26.35 42.21,26.35 42.21,26.69 42.86,27.34 R6.1 | C12.1 v60.33,55.56 | R19.1 R20.1 R21.1 | R21.1 R22.2 R23.2 | R21.1 v58.42,67.31
  other vias: 44.77,20.64
  pour Top: 42.46,22.65 42.46,19.1 46.19,19.1 46.19,23.91 42.47,23.91 42.47,22.65
  pour Route15: 0,90 70,90 70,0 0,0
+5V  (via drill 0.35)
  Top 0.254: IC1.7 35.42,37.33 35.24,37.15 35.24,35.24 35.88,34.61 C2.1
  Top 0.305: v62.23,31.43 58.74,31.43 SV3.2
  Top 0.406: F2.2 16.01,23.31 27.3,34.61 v34.92,34.61 C2.1
  Route15 0.305: v34.92,34.61 34.92,33.02 41.23,26.72 41.23,26.07 52.69,14.61 58.42,14.61 62.23,18.41 62.23,30.48 v62.23,31.43
A
  Top 0.406: X2.2 11.02,18.64 13.65,21.27 13.65,28.26 32.39,46.99 R24.2 38.42,46.99 39.37,47.94 IC5.12
ANT
  Top 0.293: U$2.ANT arc-90 35.61,75.47 35.51,75.56 C17.1 35.56,78.47 U$3.1
B
  Top 0.406: X2.3 11.05,23.72 13.05,25.72 13.05,28.51 32.14,47.6 34.9,47.6 36.2,48.9 R24.1 37.15,49.21 IC5.11
BAT+  (via drill 0.35)
  Top 0.254: IC1.5 35.65,38.33 35.56,38.42 35.56,40.01 35.88,40.32 U$1.1
  Top 0.293: IC2.7 42.09,24.57 42.92,25.4 45.09,25.4 C6.2
  Top 0.406: U$1.1 C1.1 30.16,42.55 v20.32,32.7 | R5.1 45.72,27.95 C6.2 45.72,24.76 v46.04,24.45 | R11.2 53.12,17.05 v52.7,17.46
  Top 1.016: F1.2 12.06,84.08 v12.06,82.87
  Bottom 1.016: v12.06,82.87 12.06,75.56 10.48,73.98 10.48,50.48 6.35,46.35 6.35,44.45 8.26,42.55 19.05,42.55 20.32,41.27 v20.32,32.7 20.32,9.53 26.35,3.49 35.88,3.49 49.85,17.46 | 49.85,17.46 v52.7,17.46 | v46.04,24.45 46.04,21.27 49.85,17.46
BAT+_UNFUSED
  Top 1.016: F1.1 21.33,86 U1.5 23,85.55 23.81,86.36 24.17,86 JP2.1
BAT-  (via drill 0.35)
  Top 0.2: 46.2,8.57 IC3.8 | IC3.9
  Top 0.203: 47.7,7.86 IC3.15 | IC3.9 46.2,8.57
  Top 0.254: 46.2,8.57 46.99,8.57 47.7,7.86 | v45.72,10.24 45.72,9.37 IC3.8
  Top 0.293: R9.2 39.94,18.48 42.37,18.48 42.59,18.26 IC2.5
  Top 0.406: R7.1 44.13,35.88 C5.2 48.26,35.88 49.53,34.61 49.53,25.72 | C10.1 46.99,2.46 | 46.99,2.46 48.14,2.46 C9.1 R12.1 | 46.99,2.46 46.99,5.71 47.7,6.43 IC3.15 | R10.1 45.92,16.71 v45.72,16.51
  Top 0.61: 27.89,5.67 v27.94,5.71
  Top 1.016: U1.4 27.89,5.67 | JP2.2 31.27,84.93 27.3,80.96 27.3,79.06 25.08,76.83 13.02,76.83 6.64,70.46 X1.1 3.73,68.56 JP1.2
  Route2 0.406: v45.72,16.51 v45.72,10.24
  Bottom 0.61: v27.94,5.71 34.92,5.71 v45.72,16.51
  Bottom 1.016: v27.94,5.71 22.86,10.79 22.86,76.2 27.94,81.28 27.94,81.6 31.27,84.93 JP2.2
  pour Top (isolate 0.305): 42.48,18.63 42.48,15.26 50.88,15.26 50.88,26.86 50.56,27.18 46.92,27.18 46.92,23.73 47.23,23.73 47.23,18.62 42.49,18.62
CELLX  (via drill 0.35)
  Top 0.2: IC3.10 45.57,8.09 v45.09,8.57
  Top 0.203: v51.44,9.21 51.7,8.94 Q3.1 52.38,7.94 52.7,7.62 52.7,6.13 R12.2
  Route2 0.203: v45.09,8.57 50.8,8.57 v51.44,9.21
CHIP_PU
  Top 0.406: IC4.8 55.77,49.64 54.61,50.8 R18.1 C11.1 58.74,58.1 58.74,62.87 59.69,63.81 C3.2 Q2.3
CUT
  cutout Top: 43.18,15.88 43.18,6.35 34.29,6.35 34.29,15.88
DTR
  Top 0.406: R16.2 R14.2 Q1.2 65.7,67.48 67.38,67.48 68.87,68.96 68.87,74.23 66.93,76.17 61.66,76.17 60.1,74.61 58.74,74.61 56.52,76.83 56.52,83.51 57,83.99 57,84.92 56.34,85.57 55.42,85.57 54.3,84.45 SV2.6
EN_PERIPHERAL  (via drill 0.35)
  Top 0.305: R1.2 56.83,15.88 v56.2,16.51 | v40.22,35.56 40.22,36.02 IC1.1
  Top 0.406: IC4.6 57.37,49.31 v57.15,49.53 | IC5.4 49.85,49.21 v50.48,48.58 49.85,47.94 IC5.3
  Route15 0.406: v57.15,49.53 51.44,49.53 v50.48,48.58
  Bottom 0.305: v56.2,16.51 40.22,32.48 v40.22,35.56 40.22,39.6 42.58,41.96 42.59,41.96 49.21,48.58 v50.48,48.58
GND  (via drill 0.35)
  Top 0.2: IC1.2 38.21,37.33 IC1.9 | IC3.7 49.2,10.98 R10.2
  other vias: 49.53,5.08 46.67,10.16
  pour Top (rank 6): 0,90 -0.19,0.41 70,0 70,90
  pour Bottom: 0,90 0.32,0.32 70,0 70,90
  pour Route2: -2.54,-2.22 72.07,-2.22 72.07,92.08 -2.54,92.08 -2.54,-1.91
GNDINT  (via drill 0.35)
  Top 0.2: IC7.9 45.72,86.36 46.35,85.72 | 46.35,85.72 46.67,85.41 C19.2 46.99,84.14 45.84,82.98 IC6.4 43.93,82.98 43.5,82.55 IC6.9 43.25,81.98 IC6.7 | IC7.8 45.4,85.86 | 45.4,85.86 46.22,85.86 46.35,85.72 | IC7.5 42.36,85.86 42.23,85.72 42.23,85.09 42.55,84.77 44.45,84.77 | 45.4,85.86 45.4,85.72 44.45,84.77 | IC7.3 41.52,86.86 v41.46,86.81 | 44.45,84.77 43.81,84.14 v42.55,84.14
  Top 0.406: C19.2 48.26,84.14 v48.26,83.82 | Q3.6 54.29,8.33 v54.29,9.21 | IC5.7 45.88,52.39 | 45.88,52.39 v44.45,52.39 | IC5.6 45.88,52.39
  Route2 0.2: v41.46,86.81 41.46,85.22 v42.55,84.14
  Route2 0.305: 52.07,24.77 52.07,26.04 54.29,28.26 57.15,28.26 58.1,27.3
  Route2 0.406: 58.1,27.3 SV3.6 | v54.29,9.21 54.29,22.23 54.45,22.38 52.07,24.77 47.94,28.89 43.81,28.89 40.96,31.75 40.96,47.94 40.96,53.98 | v48.26,83.82 46.35,83.82 40.96,78.42 40.96,53.98 | 40.96,53.98 42.86,53.98 v44.45,52.39
GPIO1  (via drill 0.35)
  Top 0.305: IC4.13 48.69,46.15 v48.26,45.72
  Top 0.406: R23.1 54.44,71.26 U$2.RST 49.04,71.26 v48.9,71.12
  Route2 0.406: v48.9,71.12 48.9,70.25 50.55,68.59 50.55,62.63 50.48,62.56 50.48,54.51 51.48,53.51 51.48,50.95 47.94,47.41 47.94,46.04 v48.26,45.72
GPIO2  (via drill 0.35)
  Top 0.406: U$2.DIO0 38.56,65.26 v38.73,65.09 | IC4.5 58.17,51.05 v58.1,51.12
  Route15 0.406: v38.73,65.09 39.95,63.88 39.95,55.88 41.85,53.98 55.24,53.98 v58.1,51.12
GPIO4  (via drill 0.35)
  Top 0.305: IC4.18 48.16,42.15 v48.14,42.12
  Top 0.406: R21.2 54.88,67.26 U$2.SCK 48.94,67.26 v48.9,67.31
  Route2 0.406: v48.9,67.31 48.9,66.12 49.95,65.07 49.95,62.88 49.82,62.75 49.82,54.31 50.87,53.26 50.87,51.2 47.28,47.61 47.28,42.89 48.05,42.12 v48.14,42.12
GPIO5  (via drill 0.35)
  Top 0.305: IC4.19 48.65,41.34 v48.58,41.27
  Top 0.406: R19.2 54.53,63.26 U$2.MISO 51.73,63.18 v49.21,63.18
  Route2 0.406: v49.21,63.18 49.21,54.06 50.26,53.01 50.26,51.45 46.67,47.86 46.67,42.55 47.94,41.27 v48.58,41.27
GPIO6  (via drill 0.35)
  Top 0.305: IC4.20 49.75,40.55 v49.53,40.32
  Top 0.406: R20.2 54.76,65.26 U$2.MOSI 49.07,65.26 v48.9,65.09
  Route2 0.406: v48.9,65.09 48.48,64.67 48.48,62.88 48.58,62.78 48.58,53.84 49.66,52.76 49.66,51.7 46.07,48.11 46.07,42.29 48.04,40.32 v49.53,40.32
GPIO7  (via drill 0.35)
  Top 0.305: IC4.21 50.54,39.74 50.16,39.37 v49.53,39.37
  Top 0.406: R22.1 54.66,69.26 U$2.NSS 48.94,69.26 v48.9,69.22
  Route2 0.406: v48.9,69.22 48.9,68.35 47.87,67.33 47.87,62.63 47.97,62.53 47.97,53.59 49.05,52.51 49.05,51.95 45.46,48.36 45.46,42.04 47.91,39.59 49.31,39.59 v49.53,39.37
GPIO18  (via drill 0.35)
  Top 0.406: U$2.DIO1 38.34,63.26 v38.42,63.18 | IC4.26 54.17,35.24 54.17,34.8 v53.34,33.97
  Route15 0.406: v38.42,63.18 39.34,62.26 39.34,39.4 45.75,32.99 52.36,32.99 v53.34,33.97
GPIO19  (via drill 0.35)
  Top 0.406: U$2.DIO2 38.09,61.26 v38.1,61.28 | IC4.27 54.97,34.33 v54.93,34.29
  Route15 0.406: v38.1,61.28 38.73,60.64 38.73,39.05 45.4,32.38 53.02,32.38 v54.93,34.29
KEEP1
  cutout Top: 63,50 63,34 70,34 70,50
  cutout Route2: 63,50 63,34 70,34 70,50
  cutout Route15: 63,50 63,34 70,34 70,50
  cutout Bottom: 63,50 63,34 70,34 70,50
N$1
  Top 0.254: IC1.4 39.41,39.65 38.73,40.32 U$1.2
N$2
  Top 0.305: Q3.5 55.24,7.29 | 55.24,7.29 56.82,7.29 R4.1 | R1.1 55.24,10.48 55.24,7.29
N$3
  Top 0.254: R14.1 63.81,72.7 63.5,72.39 63.5,68.9 63.01,68.41 Q2.1
N$4
  Top 0.406: R13.1 59.69,73.34 61.91,75.56 66.67,75.56 68.26,73.98 68.26,69.22 67.46,68.41 Q1.1
N$7
  Top 0.293: IC2.3 41.59,15.88 41.27,15.56 38.1,15.56 37.47,14.92 37.47,11.22 L1.2
N$8
  Top 0.293: IC2.4 42.09,11.15 L1.1
N$9
  Top 0.293: IC2.9 41.09,23.75 40.32,24.51 40.32,31.43 39.53,32.23 39.21,32.23
  Top 0.406: R8.2 39.21,32.23 39.69,32.7 R7.2 R6.2
N$10  (via drill 0.35)
  Top 0.293: IC2.8 41.59,24.77 42.86,26.04 43.81,26.04 44.45,26.67 44.45,28.57 R5.2
  Top 0.406: C5.1 R5.2 45.09,30.8 v44.77,31.11 | v25.4,61.28 7.99,61.28 JP1.1
  Bottom 0.406: X1.2 9.21,71.97 9.21,65.94 JP1.1 | v44.77,31.11 44.77,40.96 51.75,47.94 51.75,49.53 44.77,56.52 30.16,56.52 v25.4,61.28
N$11
  Top 0.406: R8.1 C8.2
N$12
  Top 0.293: IC2.10 40.59,23.55 C8.1
N$14  (via drill 0.35)
  Top 0.254: Q3.3 51.09,6.03
  Top 0.406: 51.09,6.03 v50.48,6.03 | v53.02,9.53 53.02,10.96 R11.1
  Route15 0.406: v50.48,6.03 53.02,8.57 v53.02,9.53
N$16
  Top 0.406: F2.1 13.99,7.92 8.26,13.65 5.73,13.65 X2.1
N$19
  Top 0.293: J1.3 35.56,84.5 C18.1 35.51,82.59 U$3.2
REG
  Top 0.2: IC3.11 44.84,7.69
  Top 0.203: 44.84,7.69 44.45,7.3 44.45,5.08 45.17,4.36 C10.2
RS485_RX
  Top 0.406: IC4.12 48.53,46.95 48.26,46.67 IC5.2
RS485_TX
  Top 0.406: IC5.5 45.09,50.48 44.77,50.16 44.77,45.09 46.11,43.74 IC4.16
RT
  Top 0.293: IC2.1 39.04,17.47 R9.1
RTS
  Top 0.406: Q2.2 60.33,70.17 R13.2 | R13.2 R15.1 | SV2.4 55.88,76.2 58.1,73.98 58.1,71.75 59.05,70.81 R13.2
SCL  (via drill 0.35)
  Top 0.2: v67.31,63.82 v67.31,63.81 | IC3.14 45.75,6.03 45.72,6.03
  Top 0.254: 45.75,6.03 45.72,6.03 v45.09,6.03 | R3.1 48.26,78.11 46.67,78.11 | 46.67,78.11 40.32,78.11 39.69,78.74 39.69,80.33 40.81,81.45 40.81,82.72 | 46.67,78.11 46.67,78.42 v46.99,78.74 | v67.31,63.81 C4.2 | IC6.6 41.06,82.48 40.81,82.72 | IC7.2 43.25,87.56 42.86,87.95 40.96,87.95 40.32,87.31 40.32,83.22 40.81,82.72
  Top 0.305: v49.54,37.46 50.18,38.1 52.42,38.1 IC4.23
  Top 0.406: Q1.3 C4.2
  Route2 0.2: v45.09,6.03 47.31,6.03 47.86,6.58 49.04,6.58 50.22,5.4 52.96,5.4 57.78,10.23
  Route2 0.305: v49.54,37.46 50.48,38.4 50.48,41.27 48.9,42.86 48.9,45.09 52.03,48.22 52.03,53.74 51.12,54.66 51.12,70.17 46.35,74.93 46.35,78.11 v46.99,78.74 | 57.78,10.23 58.1,10.55 58.1,21.27 55.56,23.81 SV3.7
  Route15 0.254: v46.99,78.74 52.39,78.74 v67.31,63.82
  Route15 0.305: v49.54,37.46 51.52,35.48 55.42,35.48 57.24,33.66 60.01,33.66 60.96,32.7 60.96,23.5 60.01,22.54 56.83,22.54 55.56,23.81 SV3.7
SDA  (via drill 0.35)
  Top 0.2: IC6.5 41.59,82.98 41.27,83.3 41.27,83.82 41.27,85.72 41.91,86.36 IC7.4 | IC3.13 45.18,6.89
  Top 0.254: 45.18,6.89 v45.09,6.99 | 41.27,83.82 v41.59,83.82 | v42.23,77.15 42.73,77.65 51.61,77.65 R2.1
  Top 0.305: R17.1 46.35,38.1 v48.9,38.1 49.48,38.69 50.2,38.69 50.45,38.95 IC4.22 | S1.3 7.85,46.44 v8.89,45.4
  Route2 0.2: v45.09,6.99 53.66,6.99 57.15,10.48
  Route2 0.305: v42.23,77.15 47.32,72.06 47.32,51 44.9,48.59 44.9,41.81 47.68,39.03 47.96,39.03 v48.9,38.1 | 57.15,10.48 57.15,21.27 54.29,24.13 54.29,25.72 SV3.5
  Route15 0.254: v41.59,83.82 41.59,77.79 v42.23,77.15
  Route15 0.305: v48.9,38.1 48.9,37.78 48.85,37.74 48.85,37.17 51.06,34.97 55.21,34.97 56.83,33.35 56.83,28.26 SV3.5
  Bottom 0.305: v8.89,45.4 15.56,52.07 15.56,65.41 20.32,70.17 20.32,83.19 25.4,88.27 36.2,88.27 40.64,83.82 v41.59,83.82
SW
  Top 0.203: IC3.3 Q3.2 | Q3.2
U0RXD
  Top 0.305: IC4.30 57.37,34.19 55.56,32.38 SV3.1
  Route2 0.305: SV2.5 51.75,85.41 51.75,54.73 52.54,53.95 52.54,38.9 56.52,34.92 56.52,33.34 55.56,32.38 SV3.1
U0TXD
  Top 0.305: IC4.31 58.17,34.04 56.83,32.7 56.83,30.8 SV3.3
  Route2 0.305: SV2.3 54.61,85.72 54.61,83.82 52.39,81.6 52.26,81.6 52.26,54.94 53.04,54.16 53.04,39.11 57.02,35.13 57.02,33.13 56.83,32.94 56.83,30.8 SV3.3
Y
  Top 0.406: X3.2 9.98,29.53 12.16,29.53 34.36,51.73 34.58,51.73 35.88,53.02 R25.1 38.42,53.02 39.69,51.75 IC5.9
Z
  Top 0.406: X3.1 12.29,28.8 34.61,51.12 R25.2 37.47,50.48 IC5.10

### Text on the board
tPlace: Communication-Board / V 0.1 / by T. Poppe, 2022
tNames: - | + | + | On/Off | Setup | GND | Y | Z | B | A | 5V | -